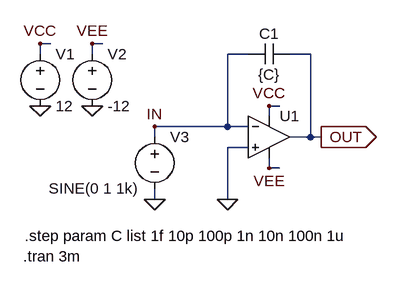
[diagram p0: schematic Capacitance_Comparator.asc]
Capacitance_Comparator.asc, the LTspice schematic file:
Version 4
SHEET 1 880 680
WIRE -288 112 -304 112
WIRE -208 112 -224 112
WIRE -304 128 -304 112
WIRE -224 128 -224 112
WIRE 16 128 -16 128
WIRE 112 128 80 128
WIRE 64 208 48 208
WIRE 48 224 48 208
WIRE -16 240 -16 128
WIRE -16 240 -128 240
WIRE 16 240 -16 240
WIRE -128 256 -128 240
WIRE 112 256 112 128
WIRE 112 256 80 256
WIRE 128 256 112 256
WIRE 16 272 -16 272
WIRE 48 304 48 288
WIRE 64 304 48 304
WIRE -128 352 -128 336
WIRE -16 352 -16 272
FLAG -304 208 0
FLAG -224 208 0
FLAG -304 112 VCC
FLAG -224 112 VEE
FLAG -16 352 0
FLAG 48 208 VCC
FLAG 48 304 VEE
FLAG 128 256 OUT
IOPIN 128 256 Out
FLAG -128 352 0
FLAG -128 240 IN
SYMBOL Opamps\\UniversalOpamp2 48 256 R0
SYMATTR InstName U1
SYMBOL voltage -304 112 R0
WINDOW 123 0 0 Left 2
WINDOW 39 0 0 Left 2
SYMATTR InstName V1
SYMATTR Value 12
SYMBOL voltage -224 112 R0
WINDOW 123 0 0 Left 2
WINDOW 39 0 0 Left 2
SYMATTR InstName V2
SYMATTR Value -12
SYMBOL cap 80 112 R90
WINDOW 0 0 32 VBottom 2
WINDOW 3 32 32 VTop 2
SYMATTR InstName C1
SYMATTR Value {C}
SYMBOL voltage -128 240 R0
WINDOW 3 -163 95 Left 2
WINDOW 123 0 0 Left 2
WINDOW 39 0 0 Left 2
SYMATTR InstName V3
SYMATTR Value SINE(0 1 1k)
TEXT -330 440 Left 2 !.tran 3m
TEXT -328 408 Left 2 !.step param C list 1f 10p 100p 1n 10n 100n 1u

The netlist it stands for:
* Capacitance_Comparator.asc
XU1 0 IN VCC VEE OUT level.2 Avol=1Meg GBW=10Meg Slew=10Meg ilimit=25m rail=0 Vos=0 phimargin=45 en=0 enk=0 in=0 ink=0 Rin=500Meg  ; pins IN+ IN- V+ V- OUT
V1 VCC 0 12
V2 VEE 0 -12
C1 OUT IN {C}
V3 IN 0 SINE(0 1 1k)
.tran 3m
.step param C list 1f 10p 100p 1n 10n 100n 1u
.lib UniversalOpamps2.sub
.backanno
.end